# Altium schematic sheet localizador.SchDoc
size A4
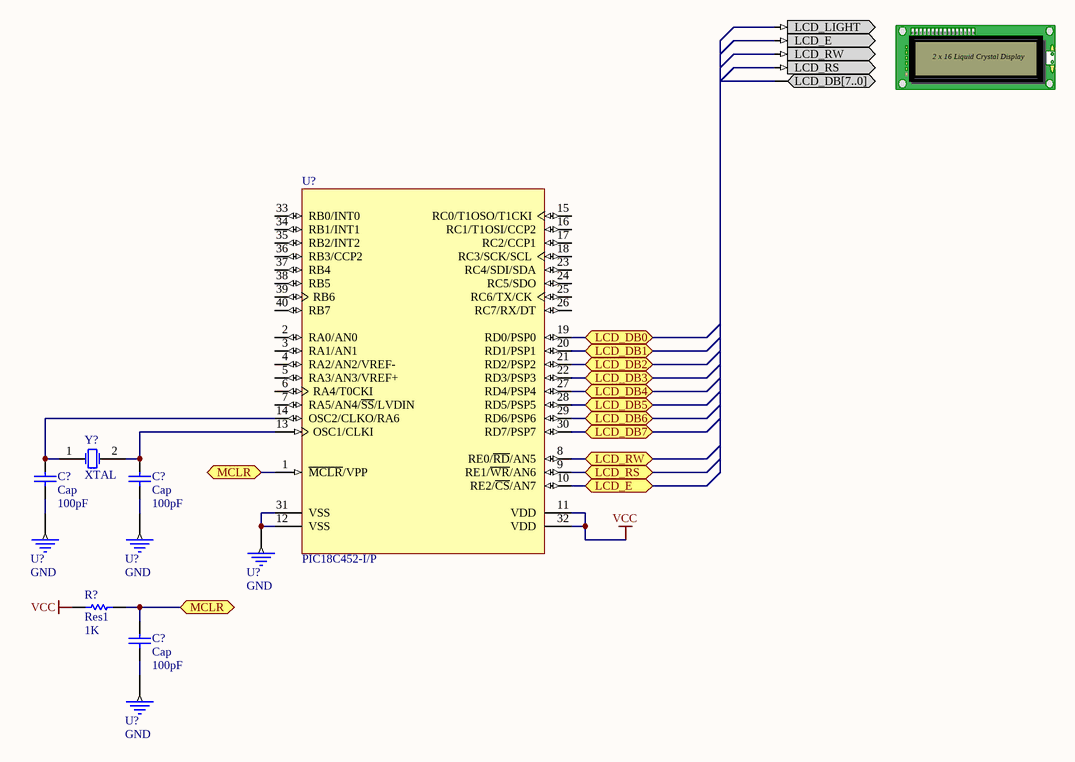
[diagram p0: localizador.SchDoc]

## Parts
(Parts that share a designator on the sheet are numbered #1, #2 ... from top to bottom, then left to right.)
?  LCD  (value not drawn)
C?#1  Cap  value 100pF  [VP32-3.2]
C?#2  Cap  value 100pF  [VP32-3.2]
C?#3  Cap  value 100pF  [VP32-3.2]
R?  Res1  value 1K  [AXIAL-0.3]
U?#1  PIC18C452-I/P  [PDIP600-40]
U?#2  GND
U?#3  GND
U?#4  GND
U?#5  GND
Y?  XTAL  [R38]

## Ports
LCD_DB0, LCD_DB1, LCD_DB2, LCD_DB3, LCD_DB4, LCD_DB5, LCD_DB6, LCD_DB7, LCD_E, LCD_RS, LCD_RW, MCLR

## Nets
VCC: R?.1 U?#1.11(VDD) U?#1.32(VDD)
LCD_DB0: U?#1.19(RD0/PSP0) ; port LCD_DB0
LCD_DB1: U?#1.20(RD1/PSP1) ; port LCD_DB1
LCD_DB2: U?#1.21(RD2/PSP2) ; port LCD_DB2
LCD_DB3: U?#1.22(RD3/PSP3) ; port LCD_DB3
LCD_DB4: U?#1.27(RD4/PSP4) ; port LCD_DB4
LCD_DB5: U?#1.28(RD5/PSP5) ; port LCD_DB5
LCD_DB6: U?#1.29(RD6/PSP6) ; port LCD_DB6
LCD_DB7: U?#1.30(RD7/PSP7) ; port LCD_DB7
LCD_E: U?#1.10(RE2/~{CS}/AN7) ; port LCD_E
LCD_RS: U?#1.9(RE1/~{WR}/AN6) ; port LCD_RS
LCD_RW: U?#1.8(RE0/~{RD}/AN5) ; port LCD_RW
MCLR: C?#3.2 R?.2 U?#1.1(~{MCLR}/VPP) ; port MCLR
NetC?#1_1: C?#1.1 U?#1.13(OSC1/CLKI) Y?.2(OSC2)
NetC?#1_2: C?#1.2 U?#3.G
NetC?#2_1: C?#2.1 U?#2.G
NetC?#2_2: C?#2.2 U?#1.14(OSC2/CLKO/RA6) Y?.1(OSC1)
NetC?#3_1: C?#3.1 U?#5.G
NetU?#1_12: U?#1.12(VSS) U?#1.31(VSS) U?#4.G

Not connected (* = marked no-connect by the designer): ? LCD_DB[7..0] LCD_E LCD_LIGHT LCD_RS LCD_RW; U?#1 2(RA0/AN0) 3(RA1/AN1) 4(RA2/AN2/VREF-) 5(RA3/AN3/VREF+) 6(RA4/T0CKI) 7(RA5/AN4/~{SS}/LVDIN) 15(RC0/T1OSO/T1CKI) 16(RC1/T1OSI/CCP2) 17(RC2/CCP1) 18(RC3/SCK/SCL) 23(RC4/SDI/SDA) 24(RC5/SDO) 25(RC6/TX/CK) 26(RC7/RX/DT) 33(RB0/INT0) 34(RB1/INT1) 35(RB2/INT2) 36(RB3/CCP2) 37(RB4) 38(RB5) 39(RB6) 40(RB7)

## Notes on the sheet
- (in symbol LCD) 2 x 16 Liquid Crystal Display

## Library data of the parts
? = LCD: Liquid Crystal Display; PortComponent: True; Published: 19-Nov-2003; Publisher: Altium Limited; HelpURL: TR0102 NanoBoard Technical Reference Manual - NB1.pdf#page=39
C?#1-C?#3 = Cap: Capacitor; Published: 8-Jun-2000; LatestRevisionDate: 17-Jul-2002; LatestRevisionNote: Re-released for DXP Platform.; PackageReference: RAD-0.3; Publisher: Altium Limited
R? = Res1: Resistor; Published: 8-Jun-2000; LatestRevisionDate: 17-Jul-2002; LatestRevisionNote: Re-released for DXP Platform.; PackageReference: AXIAL-0.3; Publisher: Altium Limited
U?#1 = PIC18C452-I/P: High Performance Microcontroller with 10-Bit A/D, 32K EPROM, 40-Pin PDIP, Standard Volt Range, Industrial Temperature; Note: Pin compatible with 40-pin PIC16C7X devices.; Note: Not recommended for new designs. Consider PIC18F452 instead.; Note: RB3 is the alternate pin for the CCP2 pin multiplexing.; Published: 11-Oct-2004; LatestRevisionDate: 04-Mar-2005; LatestRevisionNote: Stylized 3D Model Added.; DatasheetVersion: DS39026C_2001; PackageVersion: 2003; PackageReference: PDIP600-40; Publisher: Altium Limited; PackageDescription: DIP, Plastic; 40 Leads; Row Spacing 15.24 mm; Pitch 2.54 mm; Code_JEDEC: MO-011; ComponentLink1Description: Manufacturer Link; ComponentLink1URL: http://www.microchip.com; ComponentLink2Description: Datasheet; ComponentLink2URL: http://ww1.microchip.com/downloads/en/DeviceDoc/39026c.pdf; ComponentLink3Description: Packaging Specification; ComponentLink3URL: http://ww1.microchip.com/downloads/en/PackagingSpec/00049AD.pdf
U?#2-U?#5 = GND: Ground-Connection Signal Tag; FPGAVendor: Xilinx; Published: 15-Sep-2003; Publisher: Altium Limited; HelpURL: http://toolbox.xilinx.com/docsan/xilinx7/books/docs/lib/lib.pdf
Y? = XTAL: Crystal Oscillator; Published: 8-Jun-2000; LatestRevisionDate: 17-Jul-2002; LatestRevisionNote: Re-released for DXP Platform.; PackageReference: R38; Publisher: Altium Limited